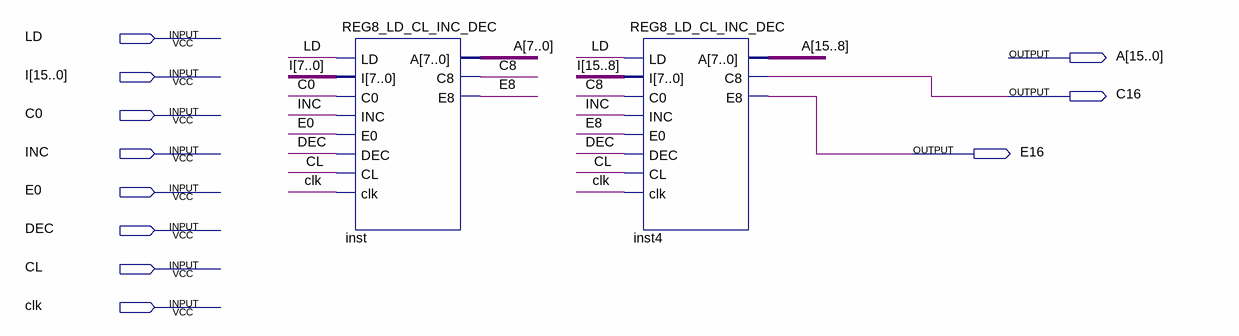
[diagram p0: schematic sheet]
// Quartus schematic REG16_LD_CL_INC_DEC.bdf as structural Verilog: 2 symbols, 11 pins
module REG16_LD_CL_INC_DEC (
  input  LD,
  input  [15:0] I,
  input  C0,
  input  INC,
  input  E0,
  input  DEC,
  input  CL,
  input  clk,
  output [15:0] A,
  output C16,
  output E16
);

  wire C8, E8;

  REG8_LD_CL_INC_DEC inst (
    .LD(LD), .I(I[7:0]), .C0(C0), .INC(INC), .E0(E0), .DEC(DEC), .CL(CL), .clk(clk), .A(A[7:0]), .C8(C8),
    .E8(E8));
  REG8_LD_CL_INC_DEC inst4 (
    .LD(LD), .I(I[15:8]), .C0(C8), .INC(INC), .E0(E8), .DEC(DEC), .CL(CL), .clk(clk), .A(A[15:8]), .C8(C16),
    .E8(E16));
endmodule
